# EAGLE schematic QSD675-Prototype (EAGLE 9.1.3)

## Sheet 1 of 6: Power Supply
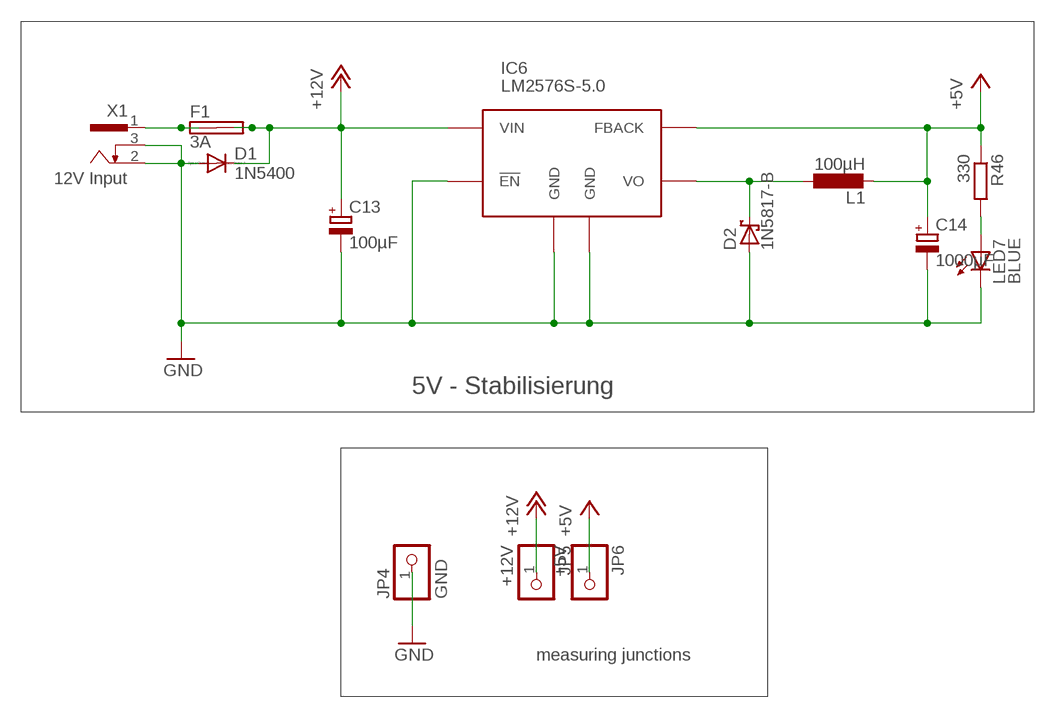
[diagram p0: schematic, sheet 1]

### Parts
C13  100µF  CPOL-EUE2.5-7  [E2,5-7]
C14  1000µF  CPOL-EUE5-10.5  [E5-10,5]
D1  1N5400  [DO201-15]
D2  1N5817-B  [DO41-7.6]
F1  3A  SH32  [SH32]
IC6  LM2576S-5.0  LM2576S  [TO263-5]
JP4  GND  PINHD-1X1  [1X01]
JP5  +12V  PINHD-1X1  [1X01]
JP6  +5V  PINHD-1X1  [1X01]
L1  100µH  L-EU0204/5  [0204/5]
LED7  BLUE  LEDSML0805  [SML0805]
R46  330  R-EU_M0805  [M0805]
X1  12V Input  733980-62  [733980-62]

### Nets
+5V: C14.+ IC6.4(FBACK) JP6.1 L1.2 R46.1 ; also sheet 3,6
+12V: C13.+ D1.C F1.2A F1.2B IC6.1(VIN) JP5.1 ; also sheet 3,5
GND: C13.- C14.- D1.A D2.A IC6.3(GND) IC6.5(!EN) IC6.TAB(GND) JP4.1 LED7.C X1.2 X1.3 ; also sheet 3,5,6
N$4: F1.1A F1.1B X1.1
N$16: D2.C IC6.2(VO) L1.1
N$18: LED7.A R46.2

### Notes on the sheet
- 5V - Stabilisierung
- measuring junctions

## Sheet 2 of 6: Drilling
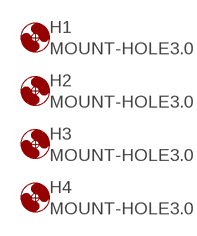
[diagram p1: schematic, sheet 2]

### Parts
H1  MOUNT-HOLE3.0  [3,0]
H2  MOUNT-HOLE3.0  [3,0]
H3  MOUNT-HOLE3.0  [3,0]
H4  MOUNT-HOLE3.0  [3,0]

## Sheet 3 of 6: Ignition Break
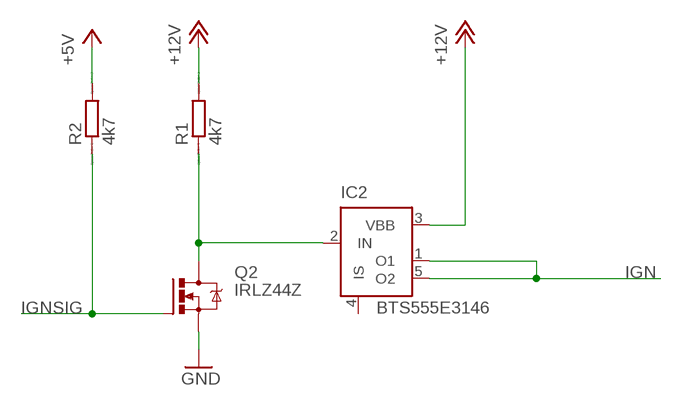
[diagram p2: schematic, sheet 3]

### Parts
IC2  BTS555E3146  [TO220-52]
Q2  IRLZ44Z  [TO220BH]
R1  4k7  R  [R0805]
R2  4k7  R  [R0805]

### Nets
+5V: R2.2 ; also sheet 1,6
+12V: IC2.3(VBB) R1.2 ; also sheet 1,5
GND: Q2.S ; also sheet 1,5,6
IGN: IC2.1(O1) IC2.5(O2) ; also sheet 5
IGNSIG: Q2.G R2.1
N$1: IC2.2(IN) Q2.D R1.1
Unconnected: IC2.4(IS)

## Sheet 4 of 6: ATmega88

## Sheet 5 of 6: Connectors
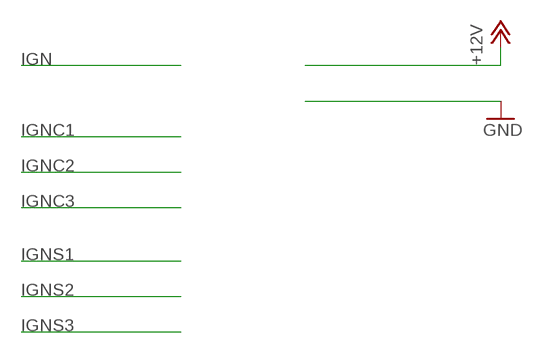
[diagram p3: schematic, sheet 5]

## Sheet 6 of 6: HC05Bluetooth
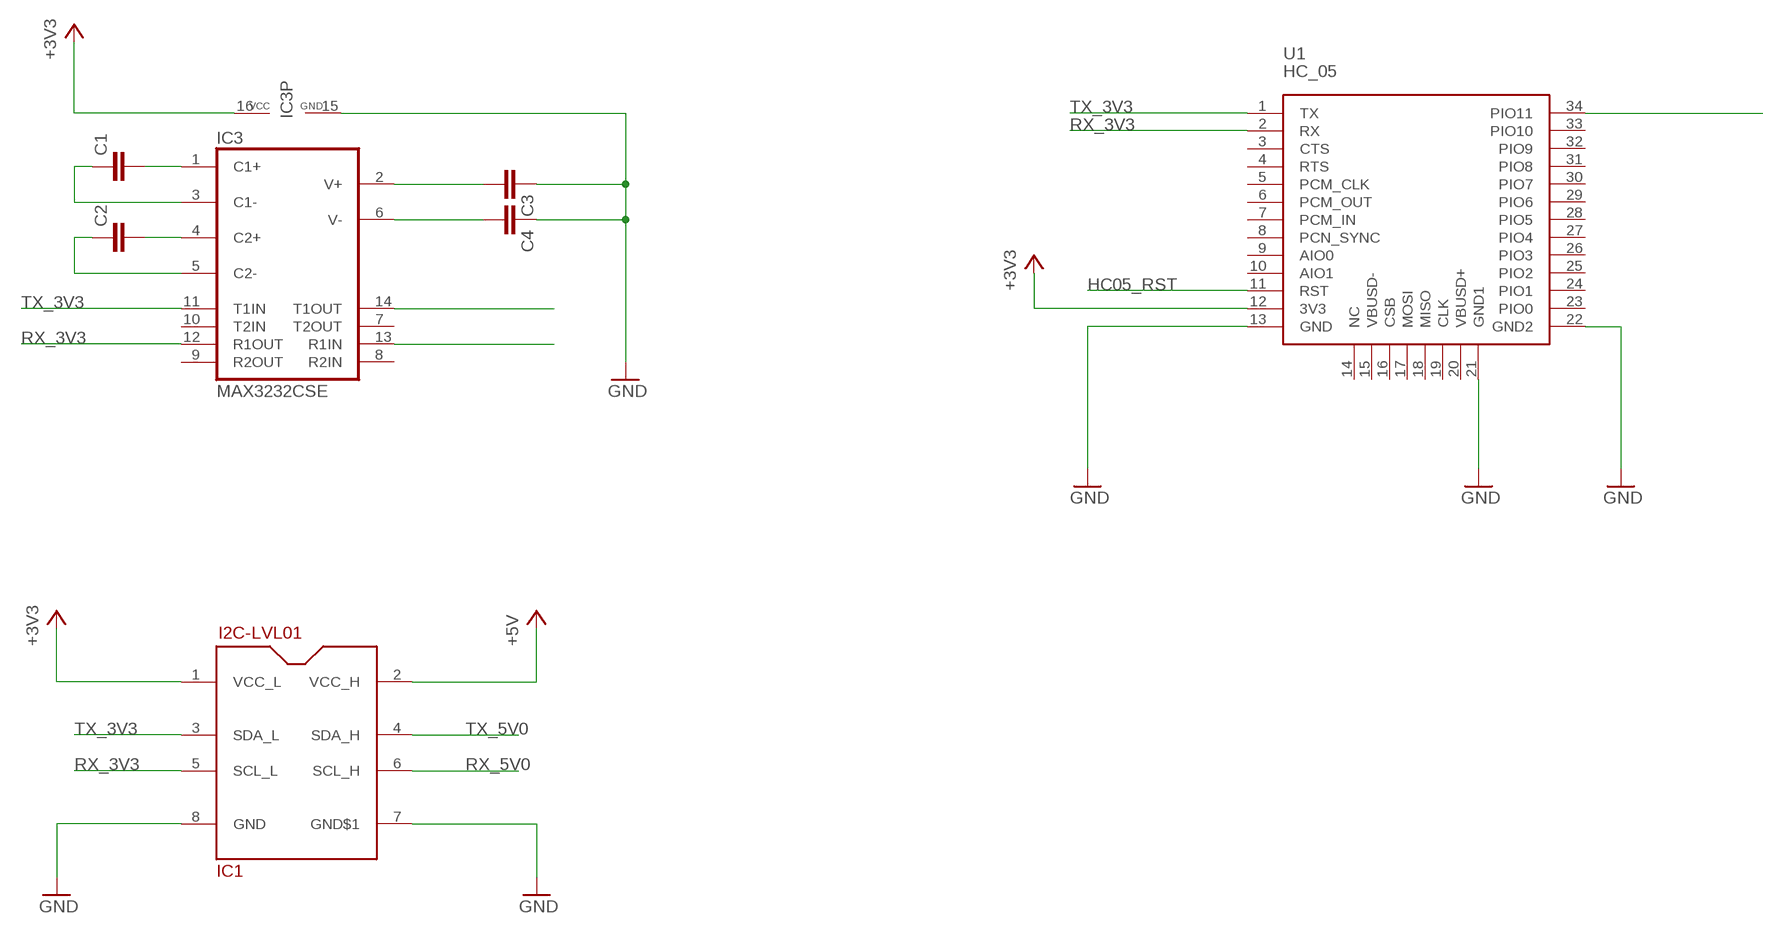
[diagram p4: schematic, sheet 6]

### Parts
C1  C-EUC0805  [C0805]
C2  C-EUC0805  [C0805]
C3  C-EUC0805  [C0805]
C4  C-EUC0805  [C0805]
IC1  I2C-LVL01  [I2C-LVL01]
IC3  MAX3232CSE  [SO16]
U1  HC_05  [BLUETOOTH_SMD]

### Nets
+3V3: IC1.1(VCC_L) IC3.16(VCC) U1.12(3V3)
+5V: IC1.2(VCC_H) ; also sheet 1,3
GND: C3.1 C4.1 IC1.7(GND$1) IC1.8(GND) IC3.15(GND) U1.13(GND) U1.21(GND1) U1.22(GND2) ; also sheet 1,3,5
HC05_RST: U1.11(RST)
N$2: U1.34(PIO11)
N$3: C1.2 IC3.1(C1+)
N$5: C1.1 IC3.3(C1-)
N$6: C2.2 IC3.4(C2+)
N$7: C2.1 IC3.5(C2-)
N$8: C3.2 IC3.2(V+)
N$9: C4.2 IC3.6(V-)
N$12: IC3.14(T1OUT)
N$13: IC3.13(R1IN)
RX_3V3: IC1.5(SCL_L) IC3.12(R1OUT) U1.2(RX)
RX_5V0: IC1.6(SCL_H)
TX_3V3: IC1.3(SDA_L) IC3.11(T1IN) U1.1(TX)
TX_5V0: IC1.4(SDA_H)
Unconnected: IC3.7(T2OUT) IC3.8(R2IN) IC3.9(R2OUT) IC3.10(T2IN) U1.3(CTS) U1.4(RTS) U1.5(PCM_CLK) U1.6(PCM_OUT) U1.7(PCM_IN) U1.8(PCN_SYNC) U1.9(AIO0) U1.10(AIO1) U1.14(NC) U1.15(VBUSD-) U1.16(CSB) U1.17(MOSI) U1.18(MISO) U1.19(CLK) U1.20(VBUSD+) U1.23(PIO0) U1.24(PIO1) U1.25(PIO2) U1.26(PIO3) U1.27(PIO4) U1.28(PIO5) U1.29(PIO6) U1.30(PIO7) U1.31(PIO8) U1.32(PIO9) U1.33(PIO10)

## Library data of the parts
C1-C4 = rcl:C-EU: CAPACITOR, European symbol; SPICEPREFIX: C
C13 C14 = rcl:CPOL-EU: POLARIZED CAPACITOR, European symbol; SPICEPREFIX: C
D1 = diode:1N5400: DIODE standard rectifier, 3 A, 50 V (Motorola)
D2 = diode:1N581*: 1.0A SCHOTTKY BARRIER RECTIFIER Source: http://www.diodes.com/datasheets/ds23001.pdf
F1 = fuse:SH32: FUSE HOLDER 6 x 32 mm, SH contact, SHH3N Schukat, 102071 Wickmann (Buerklin); MPN: 10207101009; OC_FARNELL: 811786; OC_NEWARK: 76R6904
H1-H4 = holes:MOUNT-HOLE: MOUNTING HOLE with drill center marker
IC1 = levelshift:I2C-LVL01
IC2 = infineon:BTS555: PROFET® Data Sheet BTS555 Source: http://www.infineon.com/upload/Document/cmc_upload/documents/011/8726/Datasheet_BTS555.pdf; OC_FARNELL: unknown; OC_NEWARK: unknown
IC3 = maxim:MAX3232*: True RS-232 Transceivers 3.0V to 5.5V, Low-Power up to 1Mbps, Using Four 0.1µF External Capacitors Source: http://pdfserv.maxim-ic.com/en/ds/MAX3222-MAX3241.pdf; MPN: MAX3232CSE; OC_FARNELL: 9725490; OC_NEWARK: 90C2890
IC6 = regulators:LM2576: Texas Instruments LM2576 Simple Switcher
JP4-JP6 = pinhead:PINHD-1X1: PIN HEADER
L1 = rcl:L-EU: INDUCTOR, European symbol; SPICEPREFIX: L
LED7 = led:LED: LED OSRAM: - CHIPLED LG R971, LG N971, LY N971, LG Q971, LY Q971, LO R971, LY R971 LH N974, LH R974 LS Q976, LO Q976, LY Q976 LO Q996 - Hyper CHIPLED LW Q18S LB Q993, LB Q99A, LB R99A - SideLED LS A670, LO A670, LY A670, LG A670, LP A670 LB A673, LV A673, LT A673, LW A673 LH A674 LY A675 LS A676, LA A676, LO A676, LY A676, LW A676 LS A679, LY A679, LG A679 - Hyper Micro SIDELED® LS Y876, LA Y876, LO Y876, LY Y876 LT Y87S - SmartLED LW L88C, LW L88S LB L89C, LB L89S, LG L890 LS L89K, LO L89K, LY L89K LS L896, LA L896, LO L896, LY L896 - TOPLED LS T670, LO T670, LY T670, LG T670, LP T670 LSG T670, LSP T670, LSY T670, LOP T670, LYG T670 LG T671, LOG T671, LSG T671 LB T673, LV T673, LT T673, LW T673 LH T674 LS T676, LA T676, LO T676, LY T676, LB T676, LH T676, LSB T676, LW T676 LB T67C, LV T67C, LT T67C, LS T67K, LO T67K, LY T67K, LW E67C LS E67B, LA E67B, LO E67B, LY E67B, LB E67C, LV E67C, LT E67C LW T67C LS T679, LY T679, LG T679 LS T770, LO T770, LY T770, LG T770, LP T770 LB T773, LV T773, LT T773, LW T773 LH T774 LS E675, LA E675, LY E675, LS T675 LS T776, LA T776, LO T776, LY T776, LB T776 LHGB T686 LT T68C, LB T68C - Hyper Mini TOPLED® LB M676 - Mini TOPLED Santana® LG M470 LS M47K, LO M47K, LY M47K Source: http://www.osram.convergy.de LUXEON: - LUMILED® LXK2-PW12-R00, LXK2-PW12-S00, LXK2-PW14-U00, LXK2-PW14-V00 LXK2-PM12-R00, LXK2-PM12-S00, LXK2-PM14-U00 LXK2-PE12-Q00, LXK2-PE12-R00, LXK2-PE12-S00, LXK2-PE14-T00, LXK2-PE14-U00 LXK2-PB12-K00, LXK2-PB12-L00, LXK2-PB12-M00, LXK2-PB14-N00, LXK2-PB14-P00, LXK2-PB14-Q00 LXK2-PR12-L00, LXK2-PR12-M00, LXK2-PR14-Q00, LXK2-PR14-R00 LXK2-PD12-Q00, LXK2-PD12-R00, LXK2-PD12-S00 LXK2-PH12-R00, LXK2-PH12-S00 LXK2-PL12-P00, LXK2-PL12-Q00, LXK2-PL12-R00 Source: www.luxeon.com KINGBRIGHT: KA-3528ASYC Source: www.kingbright.com
Q2 = transistor-power:IRLZ44Z: N-Channel HEXFET® Power MOSFET Logic Level AUTOMOTIVE MOSFET Source: http://www.irf.com/product-info/datasheets/data/irlz44zpbf.pdf
R1 R2 = eagle-ltspice:R: RESISTOR, European symbol; SPICEMODEL: NONE; SPICEPREFIX: R
R46 = rcl:R-EU_: RESISTOR, European symbol; SPICEPREFIX: R
U1 = Bluetooth HC-05:HC_05: HC-05 Bluetooth Module
X1 = con-conrad:73398?: FEMALE PRINT CONNECTOR Niedervolt-Steckverbinder Distributor Conrad